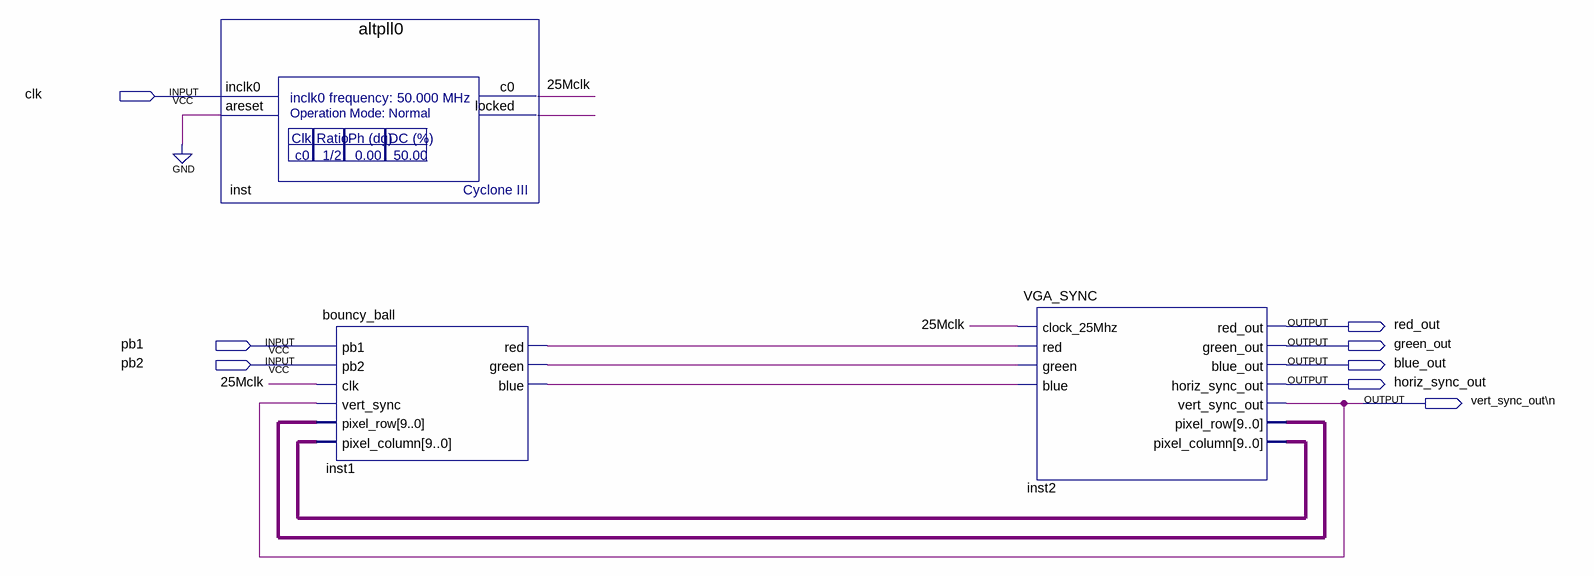
[diagram p0: schematic sheet]
// Quartus schematic Bouncy_Example.bdf as structural Verilog: 3 symbols, 8 pins
module Bouncy_Example (
  input  clk,
  input  pb1,
  input  pb2,
  output red_out,
  output green_out,
  output blue_out,
  output horiz_sync_out,
  output \vert_sync_out\n 
);

  wire \25Mclk , inst1_blue, inst1_green, inst1_red, inst_locked;
  wire [9:0] inst2_pixel_column, inst2_pixel_row;

  altpll0 inst (.inclk0(clk), .areset(1'b0), .c0(\25Mclk ), .locked(inst_locked));
  bouncy_ball inst1 (
    .pb1(pb1), .pb2(pb2), .clk(\25Mclk ), .vert_sync(\vert_sync_out\n ), .pixel_row(inst2_pixel_row),
    .pixel_column(inst2_pixel_column), .red(inst1_red), .green(inst1_green), .blue(inst1_blue));
  VGA_SYNC inst2 (
    .clock_25Mhz(\25Mclk ), .red(inst1_red), .green(inst1_green), .blue(inst1_blue), .red_out(red_out),
    .green_out(green_out), .blue_out(blue_out), .horiz_sync_out(horiz_sync_out),
    .vert_sync_out(\vert_sync_out\n ), .pixel_row(inst2_pixel_row), .pixel_column(inst2_pixel_column));
endmodule
